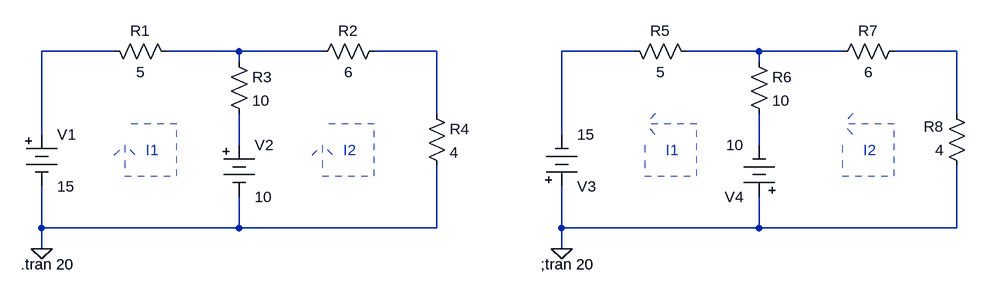
[diagram p0: schematic LAB_006_Tonino_Kent_Louise.asc]
LAB_006_Tonino_Kent_Louise.asc, the LTspice schematic file:
Version 4
SHEET 1 1640 680
WIRE 240 -32 128 -32
WIRE 432 -32 320 -32
WIRE 560 -32 432 -32
WIRE 736 -32 640 -32
WIRE 1040 -32 928 -32
WIRE 1232 -32 1120 -32
WIRE 1360 -32 1232 -32
WIRE 1536 -32 1440 -32
WIRE 432 -16 432 -32
WIRE 1232 -16 1232 -32
WIRE 736 64 736 -32
WIRE 1536 64 1536 -32
WIRE 128 96 128 -32
WIRE 928 96 928 -32
WIRE 432 112 432 64
WIRE 1232 112 1232 64
WIRE 128 240 128 176
WIRE 432 240 432 192
WIRE 432 240 128 240
WIRE 736 240 736 144
WIRE 736 240 432 240
WIRE 928 240 928 176
WIRE 1232 240 1232 192
WIRE 1232 240 928 240
WIRE 1536 240 1536 144
WIRE 1536 240 1232 240
WIRE 128 272 128 240
WIRE 928 272 928 240
FLAG 128 272 0
FLAG 928 272 0
SYMBOL res 224 -48 M90
WINDOW 0 0 56 VBottom 2
WINDOW 3 32 56 VTop 2
SYMATTR InstName R1
SYMATTR Value 5
SYMBOL res 416 -32 R0
SYMATTR InstName R3
SYMATTR Value 10
SYMBOL res 544 -16 R270
WINDOW 0 32 56 VTop 2
WINDOW 3 0 56 VBottom 2
SYMATTR InstName R2
SYMATTR Value 6
SYMBOL res 720 48 R0
SYMATTR InstName R4
SYMATTR Value 4
SYMBOL Misc\\battery 128 80 R0
WINDOW 123 0 0 Left 0
WINDOW 39 0 0 Left 0
SYMATTR InstName V1
SYMATTR Value 15
SYMBOL Misc\\battery 432 96 R0
WINDOW 123 0 0 Left 0
WINDOW 39 0 0 Left 0
SYMATTR InstName V2
SYMATTR Value 10
SYMBOL res 1136 -16 M270
WINDOW 0 32 56 VTop 2
WINDOW 3 0 56 VBottom 2
SYMATTR InstName R5
SYMATTR Value 5
SYMBOL res 1216 -32 R0
SYMATTR InstName R6
SYMATTR Value 10
SYMBOL res 1456 -48 R90
WINDOW 0 0 56 VBottom 2
WINDOW 3 32 56 VTop 2
SYMATTR InstName R7
SYMATTR Value 6
SYMBOL res 1552 160 R180
WINDOW 0 36 76 Left 2
WINDOW 3 36 40 Left 2
SYMATTR InstName R8
SYMATTR Value 4
SYMBOL Misc\\battery 928 192 M180
WINDOW 123 0 0 Left 0
WINDOW 39 0 0 Left 0
SYMATTR InstName V3
SYMATTR Value 15
SYMBOL Misc\\battery 1232 208 R180
WINDOW 123 0 0 Left 0
WINDOW 39 0 0 Left 0
SYMATTR InstName V4
SYMATTR Value 10
TEXT 96 296 Left 2 !.tran 20
TEXT 592 120 Left 2 ;I2
TEXT 288 120 Left 2 ;I1
TEXT 896 296 Left 2 !;tran 20
TEXT 1392 120 Left 2 ;I2
TEXT 1088 120 Left 2 ;I1
LINE Normal 640 80 560 80 2
LINE Normal 640 160 640 80 2
LINE Normal 560 160 640 160 2
LINE Normal 560 112 560 160 2
LINE Normal 576 128 560 112 2
LINE Normal 544 128 560 112 2
LINE Normal 336 80 256 80 2
LINE Normal 336 160 336 80 2
LINE Normal 256 160 336 160 2
LINE Normal 256 112 256 160 2
LINE Normal 272 128 256 112 2
LINE Normal 240 128 256 112 2
LINE Normal 1440 80 1360 80 2
LINE Normal 1440 160 1440 80 2
LINE Normal 1360 160 1440 160 2
LINE Normal 1360 112 1360 160 2
LINE Normal 1136 80 1056 80 2
LINE Normal 1136 160 1136 80 2
LINE Normal 1056 160 1136 160 2
LINE Normal 1056 112 1056 160 2
LINE Normal 1376 64 1360 80 2
LINE Normal 1376 96 1360 80 2
LINE Normal 1072 64 1056 80 2
LINE Normal 1072 96 1056 80 2

The netlist it stands for:
* LAB_006_Tonino_Kent_Louise.asc
R1 N001 N002 5
R3 N002 N007 10
R2 N002 N003 6
R4 N003 0 4
V1 N001 0 15
V2 N007 0 10
R5 N005 N004 5
R6 N005 N008 10
R7 N006 N005 6
R8 0 N006 4
V3 0 N004 15
V4 0 N008 10
.tran 20
* I2
* I1
;tran 20
* I2
* I1
.backanno
.end